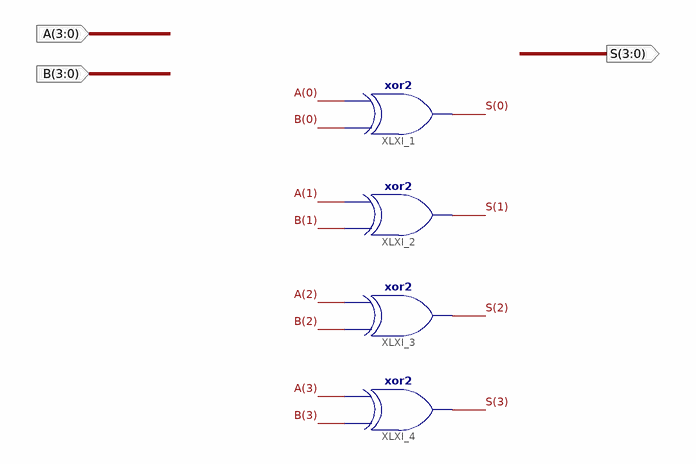
[diagram p0: schematic sheet 1]
// Xilinx ISE schematic XorGate.sch (xa9500xl) as structural Verilog: 4 symbols, 3 ports
module XorGate (
  input  [3:0] A,
  input  [3:0] B,
  output [3:0] S
);

  xor XLXI_1 (S[0], B[0], A[0]);
  xor XLXI_2 (S[1], B[1], A[1]);
  xor XLXI_3 (S[2], B[2], A[2]);
  xor XLXI_4 (S[3], B[3], A[3]);
endmodule
